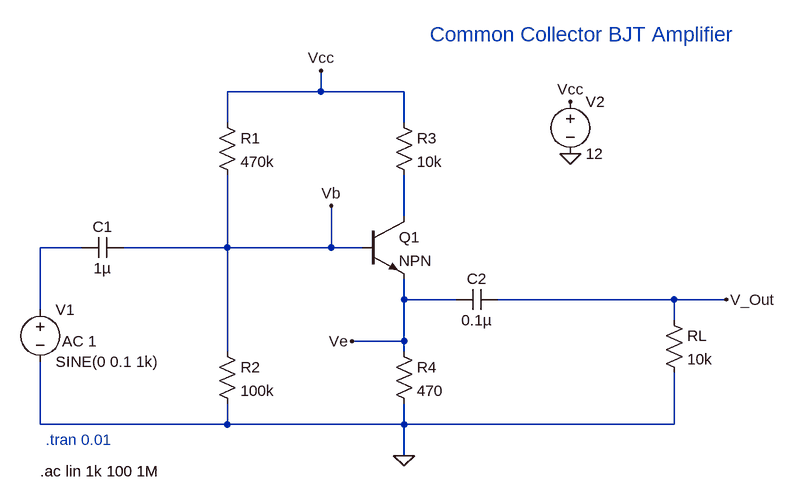
[diagram p0: schematic Common_Collector_Amplifier.asc]
Common_Collector_Amplifier.asc, the LTspice schematic file:
Version 4.1
SHEET 1 880 680
WIRE 0 -96 0 -128
WIRE 0 -96 -144 -96
WIRE 128 -96 0 -96
WIRE -144 -48 -144 -96
WIRE 128 -48 128 -96
WIRE 128 96 128 32
WIRE -368 144 -432 144
WIRE -144 144 -144 32
WIRE -144 144 -304 144
WIRE 16 144 16 80
WIRE 16 144 -144 144
WIRE 64 144 16 144
WIRE 128 224 128 192
WIRE 208 224 128 224
WIRE 544 224 272 224
WIRE 624 224 544 224
WIRE -432 240 -432 144
WIRE 544 256 544 224
WIRE 128 288 128 224
WIRE 128 288 48 288
WIRE -144 304 -144 144
WIRE 128 304 128 288
WIRE -432 416 -432 320
WIRE -144 416 -144 384
WIRE -144 416 -432 416
WIRE 128 416 128 384
WIRE 128 416 -144 416
WIRE 544 416 544 336
WIRE 544 416 128 416
WIRE 128 464 128 416
FLAG 128 464 0
FLAG 384 0 0
FLAG 384 -80 Vcc
FLAG 0 -128 Vcc
FLAG 624 224 V_Out
FLAG 16 80 Vb
FLAG 48 288 Ve
SYMBOL npn 64 96 R0
SYMATTR InstName Q1
SYMBOL voltage -432 224 R0
WINDOW 123 34 64 Left 2
WINDOW 39 0 0 Left 0
SYMATTR Value2 AC 1
SYMATTR InstName V1
SYMATTR Value SINE(0 0.1 1k)
SYMBOL cap -304 128 R90
WINDOW 0 0 32 VBottom 2
WINDOW 3 32 32 VTop 2
SYMATTR InstName C1
SYMATTR Value 1µ
SYMBOL res 112 288 R0
SYMATTR InstName R4
SYMATTR Value 470
SYMBOL res -160 288 R0
SYMATTR InstName R2
SYMATTR Value 100k
SYMBOL res -160 -64 R0
SYMATTR InstName R1
SYMATTR Value 470k
SYMBOL res 112 -64 R0
SYMATTR InstName R3
SYMATTR Value 10k
SYMBOL voltage 384 -96 R0
WINDOW 123 0 0 Left 0
WINDOW 39 0 0 Left 0
SYMATTR InstName V2
SYMATTR Value 12
SYMBOL cap 272 208 R90
WINDOW 0 0 32 VBottom 2
WINDOW 3 32 32 VTop 2
SYMATTR InstName C2
SYMATTR Value 0.1µ
SYMBOL res 528 240 R0
SYMATTR InstName RL
SYMATTR Value 10k
TEXT -432 488 Left 2 !.ac lin 1k 100 1M
TEXT -424 440 Left 2 ;.tran 0.01
TEXT 168 -184 Left 3 ;Common Collector BJT Amplifier

The netlist it stands for:
* Common_Collector_Amplifier.asc
Q1 N001 Vb Ve 0 NPN
V1 N002 0 SINE(0 0.1 1k) AC 1
C1 Vb N002 1µ
R4 Ve 0 470
R2 Vb 0 100k
R1 Vcc Vb 470k
R3 Vcc N001 10k
V2 Vcc 0 12
C2 V_Out Ve 0.1µ
RL V_Out 0 10k
.model NPN NPN
.model PNP PNP
.lib standard.bjt
.ac lin 1k 100 1M
* .tran 0.01
* Common Collector BJT Amplifier
.backanno
.end